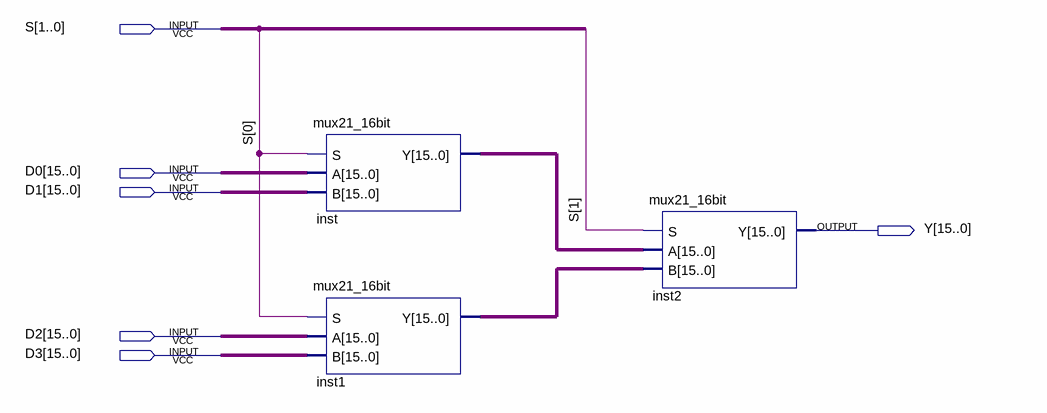
[diagram p0: schematic sheet]
// Quartus schematic mux41_16bit.bdf as structural Verilog: 3 symbols, 6 pins
module mux41_16bit (
  input  [1:0] S,
  input  [15:0] D0,
  input  [15:0] D1,
  input  [15:0] D2,
  input  [15:0] D3,
  output [15:0] Y
);

  wire [15:0] inst1_y, inst_y;

  mux21_16bit inst (.S(S[0]), .A(D0), .B(D1), .Y(inst_y));
  mux21_16bit inst1 (.S(S[0]), .A(D2), .B(D3), .Y(inst1_y));
  mux21_16bit inst2 (.S(S[1]), .A(inst_y), .B(inst1_y), .Y(Y));
endmodule
